# EAGLE board iMX233-OLinuXino-Micro_Rev_A (EAGLE 4.16), part 1 of 2
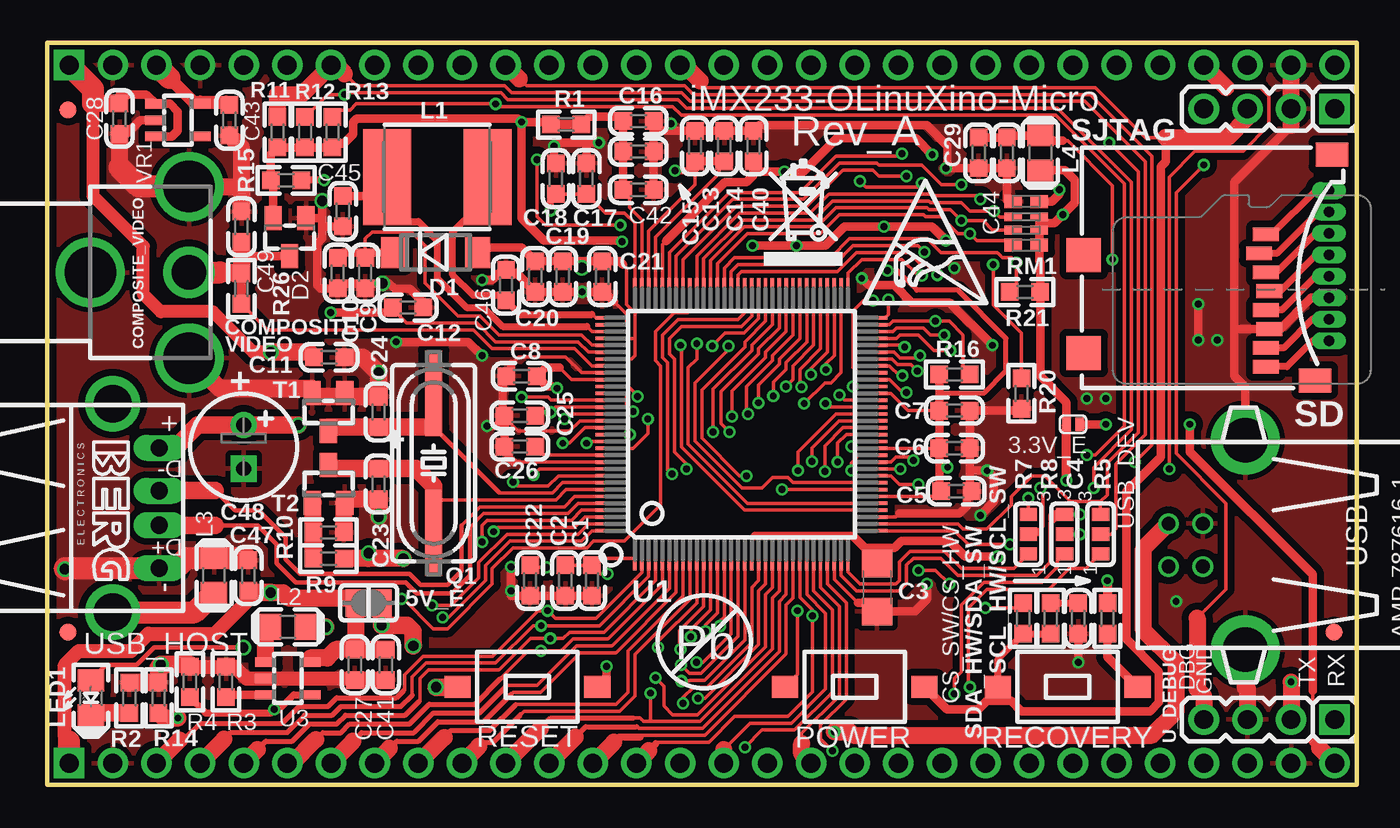
[diagram p1: board, top side]
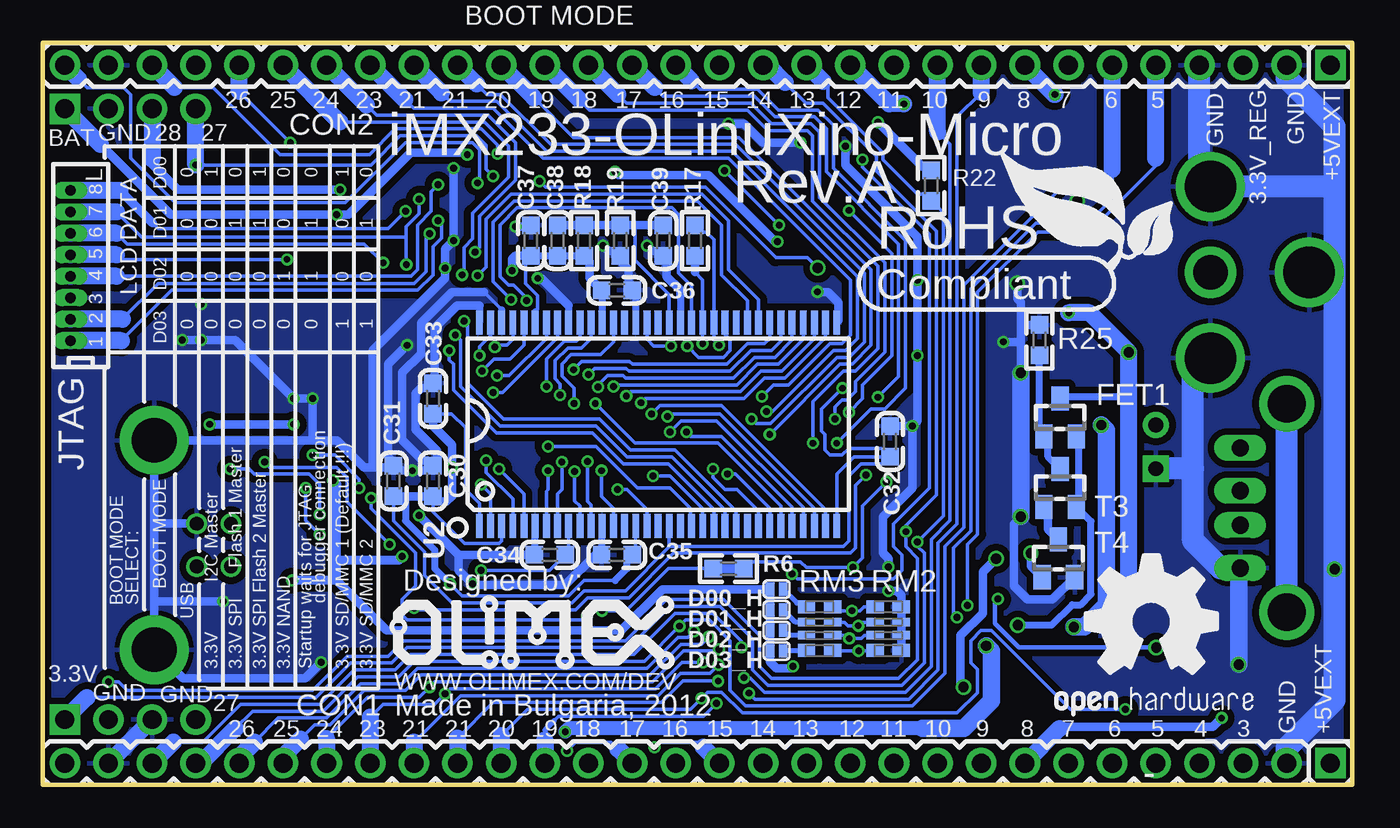
[diagram p2: board, bottom side, seen from below]

Size 76.2 x 43.2 mm. Coordinates in mm from the lower left corner, seen from the top.
Outline: 0,0 76.2,0 76.2,43.2 0,43.2 0,0
Copper layers (1+2*15+16): Top 0.035mm / dielectric 0.5mm / Route2 0.035mm / dielectric 0.5mm / Route15 0.035mm / dielectric 0.5mm / Bottom 0.035mm
Design rules "default": minimum track width 0.0051mm, minimum drill 0.3mm, track to track 0.15mm, track to pad 0.2mm, pad to pad 0.2mm, via to via 0.2mm, smd to smd 1mil, copper to edge 10mil, drill to drill 8mil, minimum pad ring 6mil, minimum via ring 0.15mm, stop-mask expansion 4mil, vias tented up to drill 25mil, thermal gap 12mil
Net classes: 1 pwr: width 0.5 mm, drill 0.2 mm
tRestrict: 1 lines

## Footprints (pad centres in the part's own frame; a part is rotated, then mirrored left to right if it is on the bottom)
SJ_1_SMALLER = smd 0.508 x 0.762: 1 -0.381,0; 2 0.381,0
SJ = smd 1.168 x 1.6: 1 -0.762,0; 2 0.762,0
C0603_DWS = smd 1.016 x 1.016: 1 -0.889,0; 2 0.889,0
C1206 = smd 1.6 x 1.8: 1 -1.4,0; 2 1.4,0
E2,5-6,3 = drill 0.864 pad 1.524 round: + -1.27,0 | drill 0.864 pad 1.524 square: - 1.27,0
VIDEO_CON = drill 3 round: GND1 -5,-5.75; GND2 0,0; GND3 5,-5.75 | drill 2 round: IO 0,-5.75
HN1X30 = drill 1.1 pad 1.778 square: 1 -36.83,0 | drill 1.1 pad 1.778 round: 2 -34.29,0; 3 -31.75,0; 4 -29.21,0; 5 -26.67,0; 6 -24.13,0; 7 -21.59,0; 8 -19.05,0; 9 -16.51,0; 10 -13.97,0; 11 -11.43,0; 12 -8.89,0; 13 -6.35,0; 14 -3.81,0; 15 -1.27,0; 16 1.27,0; 17 3.81,0; 18 6.35,0; 19 8.89,0; 20 11.43,0; 21 13.97,0; 22 16.51,0; 23 19.05,0; 24 21.59,0; 25 24.13,0; 26 26.67,0; 27 29.21,0; 28 31.75,0; 29 34.29,0; 30 36.83,0
SJ_2_SMALL = smd 0.762 x 1.016: 1 -1.143,0; 2 0,0; 3 1.143,0
MLL-41 = smd 1.45 x 1.8: A 2.445,0; K -2.445,0
SOT23C(BAT54S) = smd 1 x 1.4: 1 -0.95,-1.1; 2 0.95,-1.1; 3 0,1.1
SOT23 = smd 1 x 1.4: 1 -0.95,-1.1; 2 0.95,-1.1; 3 0,1.1
WU08S = drill 0.6 pad 0.991 long: 1 -4.375,0; 2 -3.125,0; 3 -1.875,0; 4 -0.625,0; 5 0.625,0; 6 1.875,0; 7 3.125,0; 8 4.375,0
CD53 = smd 2.794 x 5.588: 1 -2.921,0; 2 2.921,0
L0805_5MIL_DWS = smd 1.27 x 1.524: 1 -1.016,0; 2 1.016,0
LED-0805 = smd 1.27 x 1.524: A 1.016,0; C -1.016,0
SW-TAKT_6X3.5_SMD = smd 1.27 x 1.524: P$1 0,4.064; P$2 0,-4.064
HC49/SMD2_THIN = smd 5 x 1: 1 -4.064,0; 2 4.064,0
0603_0R = smd 1.016 x 1.016: 1 -0.889,0; 2 0.889,0
R0603_5MIL_DWS = smd 1.016 x 1.016: 1 -0.889,0; 2 0.889,0
R_MATRIX_4 = smd 1.016 x 0.762: 1.1 -0.762,1.27; 1.2 0.762,1.27; 4.1 -0.762,-1.27; 4.2 0.762,-1.27 | smd 1.016 x 0.508: 2.1 -0.762,0.381; 2.2 0.762,0.381; 3.1 -0.762,-0.381; 3.2 0.762,-0.381
TFR-MEM-CON = smd 0.8 x 1.5: 1 -3.2,10.7; 2 -2.1,10.3; 3 -1,10.7; 4 0.1,10.9; 5 1.2,10.7; 6 2.3,10.9; 7 3.4,10.7; 8 4.5,10.7 | smd 2 x 2: 9 3.7,0.1; 10 -2,0.1 | smd 1.4 x 1.9: 11 5.3,13.55; 12 -7.85,14.55
HN1X4 = drill 1.1 pad 1.778 square: 1 -3.81,0 | drill 1.1 pad 1.778 round: 2 -1.27,0; 3 1.27,0; 4 3.81,0
SOT-23 = smd 1 x 1.4: 1 -0.95,-1.1; 2 0.95,-1.1; 3 0,1.1
TQFP128LD = smd 0.2 x 1.5: 1 -6.2,-7.75; 2 -5.8,-7.75; 3 -5.4,-7.75; 4 -5,-7.75; 5 -4.6,-7.75; 6 -4.2,-7.75; 7 -3.8,-7.75; 8 -3.4,-7.75; 9 -3,-7.75; 10 -2.6,-7.75; 11 -2.2,-7.75; 12 -1.8,-7.75; 13 -1.4,-7.75; 14 -1,-7.75; 15 -0.6,-7.75; 16 -0.2,-7.75; 17 0.2,-7.75; 18 0.6,-7.75; 19 1,-7.75; 20 1.4,-7.75; 21 1.8,-7.75; 22 2.2,-7.75; 23 2.6,-7.75; 24 3,-7.75; 25 3.4,-7.75; 26 3.8,-7.75; 27 4.2,-7.75; 28 4.6,-7.75; 29 5,-7.75; 30 5.4,-7.75; 31 5.8,-7.75; 32 6.2,-7.75; 65 6.2,7.75; 66 5.8,7.75; 67 5.4,7.75; 68 5,7.75; 69 4.6,7.75; 70 4.2,7.75; 71 3.8,7.75; 72 3.4,7.75; 73 3,7.75; 74 2.6,7.75; 75 2.2,7.75; 76 1.8,7.75; 77 1.4,7.75; 78 1,7.75; 79 0.6,7.75; 80 0.2,7.75; 81 -0.2,7.75; 82 -0.6,7.75; 83 -1,7.75; 84 -1.4,7.75; 85 -1.8,7.75; 86 -2.2,7.75; 87 -2.6,7.75; 88 -3,7.75; 89 -3.4,7.75; 90 -3.8,7.75; 91 -4.2,7.75; 92 -4.6,7.75; 93 -5,7.75; 94 -5.4,7.75; 95 -5.8,7.75; 96 -6.2,7.75 | smd 1.5 x 0.2: 33 7.75,-6.2; 34 7.75,-5.8; 35 7.75,-5.4; 36 7.75,-5; 37 7.75,-4.6; 38 7.75,-4.2; 39 7.75,-3.8; 40 7.75,-3.4; 41 7.75,-3; 42 7.75,-2.6; 43 7.75,-2.2; 44 7.75,-1.8; 45 7.75,-1.4; 46 7.75,-1; 47 7.75,-0.6; 48 7.75,-0.2; 49 7.75,0.2; 50 7.75,0.6; 51 7.75,1; 52 7.75,1.4; 53 7.75,1.8; 54 7.75,2.2; 55 7.75,2.6; 56 7.75,3; 57 7.75,3.4; 58 7.75,3.8; 59 7.75,4.2; 60 7.75,4.6; 61 7.75,5; 62 7.75,5.4; 63 7.75,5.8; 64 7.75,6.2; 97 -7.75,6.2; 98 -7.75,5.8; 99 -7.75,5.4; 100 -7.75,5; 101 -7.75,4.6; 102 -7.75,4.2; 103 -7.75,3.8; 104 -7.75,3.4; 105 -7.75,3; 106 -7.75,2.6; 107 -7.75,2.2; 108 -7.75,1.8; 109 -7.75,1.4; 110 -7.75,1; 111 -7.75,0.6; 112 -7.75,0.2; 113 -7.75,-0.2; 114 -7.75,-0.6; 115 -7.75,-1; 116 -7.75,-1.4; 117 -7.75,-1.8; 118 -7.75,-2.2; 119 -7.75,-2.6; 120 -7.75,-3; 121 -7.75,-3.4; 122 -7.75,-3.8; 123 -7.75,-4.2; 124 -7.75,-4.6; 125 -7.75,-5; 126 -7.75,-5.4; 127 -7.75,-5.8; 128 -7.75,-6.2
66TSOP-II = smd 0.4 x 1.4: 1 -10.4,-5.925; 2 -9.75,-5.925; 3 -9.1,-5.925; 4 -8.45,-5.925; 5 -7.8,-5.925; 6 -7.15,-5.925; 7 -6.5,-5.925; 8 -5.85,-5.925; 9 -5.2,-5.925; 10 -4.55,-5.925; 11 -3.9,-5.925; 12 -3.25,-5.925; 13 -2.6,-5.925; 14 -1.95,-5.925; 15 -1.3,-5.925; 16 -0.65,-5.925; 17 0,-5.925; 18 0.65,-5.925; 19 1.3,-5.925; 20 1.95,-5.925; 21 2.6,-5.925; 22 3.25,-5.925; 23 3.9,-5.925; 24 4.55,-5.925; 25 5.2,-5.925; 26 5.85,-5.925; 27 6.5,-5.925; 28 7.15,-5.925; 29 7.8,-5.925; 30 8.45,-5.925; 31 9.1,-5.925; 32 9.75,-5.925; 33 10.4,-5.925; 34 10.4,5.925; 35 9.75,5.925; 36 9.1,5.925; 37 8.45,5.925; 38 7.8,5.925; 39 7.15,5.925; 40 6.5,5.925; 41 5.85,5.925; 42 5.2,5.925; 43 4.55,5.925; 44 3.9,5.925; 45 3.25,5.925; 46 2.6,5.925; 47 1.95,5.925; 48 1.3,5.925; 49 0.65,5.925; 50 0,5.925; 51 -0.65,5.925; 52 -1.3,5.925; 53 -1.95,5.925; 54 -2.6,5.925; 55 -3.25,5.925; 56 -3.9,5.925; 57 -4.55,5.925; 58 -5.2,5.925; 59 -5.85,5.925; 60 -6.5,5.925; 61 -7.15,5.925; 62 -7.8,5.925; 63 -8.45,5.925; 64 -9.1,5.925; 65 -9.75,5.925; 66 -10.4,5.925
SOT23-5 = smd 0.55 x 1.2: 1 -0.95,-1.3; 2 0,-1.3; 3 0.95,-1.3; 4 0.95,1.3; 5 -0.95,1.3
FIDUCIAL-1X2 = smd 1 x 1: 1 0,0
USB_NEAR_BLACK = drill 0.8 round: 1 1.25,6.5; 2 -1.25,6.5; 3 -1.25,4.5; 4 1.25,4.5 | drill 2.6 pad 4 round: P$1 -6.096,2.032; P$2 6.096,2.032
USB_PN87520_HOST_PTH = drill 1 long: 1 -3.5,2.71; 2 -1,2.71; 3 1,2.71; 4 3.5,2.71 | drill 2.2 round: P$1 6.07,0; P$2 -6.07,0
SOT-23-5 = smd 0.55 x 1.2: 1 -0.95,-1.3; 2 0,-1.3; 3 0.95,-1.3; 4 0.95,1.3; 5 -0.95,1.3

## Placement (x,y rotation side)
3.3V_E  Open  [SJ_1_SMALLER]  59.7,21 180 top
5V_E  Open  [SJ]  18.7,10.6 180 top
C1  22uF/6.3V  [C0603_DWS]  31.7,11.9 90 top
C2  22uF/6.3V  [C0603_DWS]  30.15,11.9 90 top
C3  22uF/6.3V  [C1206]  48.3,11.5 90 top
C4  100nF  [C0603_DWS]  60,9.7 270 top
C5  22uF/6.3V  [C0603_DWS]  52.9,17.1 180 top
C6  100nF  [C0603_DWS]  52.8,19.6 180 top
C7  100nF  [C0603_DWS]  52.8,21.8 180 top
C8  22uF/6.3V  [C0603_DWS]  27.6,23.8 0 top
C9  22uF/6.3V  [C0603_DWS]  18.5,29.8 90 top
C10  22uF/6.3V  [C0603_DWS]  16.9,29.8 90 top
C11  22uF/6.3V  [C0603_DWS]  16.4,24.9 180 top
C12  100nF  [C0603_DWS]  21,27.8 180 top
C13  22uF/6.3V  [C0603_DWS]  37.7,37.2 270 top
C14  100nF  [C0603_DWS]  39.4,37.2 270 top
C15  22uF/6.3V  [C0603_DWS]  34.4,36.88 180 top
C16  100nF  [C0603_DWS]  34.4,38.65 180 top
C17  22uF/6.3V  [C0603_DWS]  31.38,35.3 270 top
C18  100nF  [C0603_DWS]  29.6,35.3 270 top
C19  22uF/6.3V  [C0603_DWS]  30,29.6 90 top
C20  22uF/6.3V  [C0603_DWS]  28.4,29.6 90 top
C21  22uF/6.3V  [C0603_DWS]  32.3,29.6 90 top
C22  100nF  [C0603_DWS]  28.1,11.9 90 top
C23  33pF  [C0603_DWS]  19.29,17.53 90 top
C24  33pF  [C0603_DWS]  19.29,21.72 270 top
C25  100nF  [C0603_DWS]  27.5,21.5 0 top
C26  1uF  [C0603_DWS]  27.5,19.7 0 top
C27  22uF/6.3V  [C0603_DWS]  17.9,7 270 top
C28  22uF/6.3V  [C0603_DWS]  4.2,38.8 270 top
C29  22uF/6.3V  [C0603_DWS]  54.2,36.8 90 top
C30  100nF  [C0603_DWS]  53.5,17.7 270 bottom
C31  100nF  [C0603_DWS]  55.8,17.7 270 bottom
C32  100nF  [C0603_DWS]  26.9,20 270 bottom
C33  100nF  [C0603_DWS]  53.5,22.5 270 bottom
C34  100nF  [C0603_DWS]  46.7,13.4 0 bottom
C35  100nF  [C0603_DWS]  42.8,13.4 0 bottom
C36  100nF  [C0603_DWS]  42.8,28.8 180 bottom
C37  100nF  [C0603_DWS]  47.8,31.7 270 bottom
C38  100nF  [C0603_DWS]  46.25,31.7 90 bottom
C39  100nF  [C0603_DWS]  40.1,31.7 90 bottom
C40  22uF/6.3V  [C0603_DWS]  41.1,37.2 270 top
C41  100nF  [C0603_DWS]  19.7,7 270 top
C42  22uF/6.3V  [C0603_DWS]  34.4,34.65 180 top
C43  22uF/6.3V  [C0603_DWS]  10.6,38.7 270 top
C44  22uF/6.3V  [C0603_DWS]  55.85,36.8 90 top
C45  NA(10pF)  [C0603_DWS]  17.2,33.4 90 top
C46  NA(10pF)  [C0603_DWS]  26.7,29.1 270 top
C47  22uF/6.3V  [C0603_DWS]  11.7,12.2 90 top
C48  100uF/35V/LOWESR/105C/6.3x11mm_RM2.5  [E2,5-6,3]  11.43,19.68 270 top
C49  51pF  [C0603_DWS]  11.3,32.5 90 top
COMPOSITE_VIDEO  VIDEO_CON  [VIDEO_CON]  2.5,29.84 90 top
CON1  HN1X30  [HN1X30]  38.1,1.27 180 bottom
CON2  HN1X30  [HN1X30]  38.1,41.91 180 bottom
CS_SW/CS_HW  SDA_HW:Open/SDA_SW:Close  [SJ_2_SMALL]  57.1,14.6 90 top
D00_H  Close  [SJ_1_SMALLER]  33.5,11.4 180 bottom
D1  SCHOTKKY7.62SS2  [MLL-41]  22.6,31 0 top
D01_H  Open  [SJ_1_SMALLER]  33.5,10.2 180 bottom
D2  BAT54S  [SOT23C(BAT54S)]  14.1,31.9 180 top
D02_H  Open  [SJ_1_SMALLER]  33.5,9 180 bottom
D03_H  Close  [SJ_1_SMALLER]  33.5,7.8 180 bottom
FET1  NA(IRLML6402)  [SOT23]  17,21.4 0 bottom
JTAG  NA(WU08S)  [WU08S]  74.6,30.24 90 bottom
L1  22uH/1.5A/CD53  [CD53]  22.7,35.4 0 top
L2  FB0805/600R/2A  [L0805_5MIL_DWS]  14,9.2 180 top
L3  FB0805/600R/200mA(201209-601)  [L0805_5MIL_DWS]  9.7,12.2 270 top
L4  CL470nH/0805/1.76R/250mA  [L0805_5MIL_DWS]  57.8,36.8 90 top
LED1  LED/GREEN/3MM  [LED-0805]  2.54,5.08 90 top
POWER  T1107A(6x3,8x2,5mm)  [SW-TAKT_6X3.5_SMD]  46.99,5.71 90 top
Q1  Q24.000MHz/HC-49SM/SMD/20ppm/20pF  [HC49/SMD2_THIN]  22.48,18.74 270 top
R1  0R(Board_Mounted)  [0603_0R]  30.2,38.45 0 top
R2  560R  [R0603_5MIL_DWS]  4.78,5.08 270 top
R3  10k  [R0603_5MIL_DWS]  10.4,6 270 top
R4  10k  [R0603_5MIL_DWS]  8.3,6 270 top
R5  10k  [R0603_5MIL_DWS]  61.7,9.7 90 top
R6  0R(Board_Mounted)  [0603_0R]  36.3,12.6 0 bottom
R7  1k/1%  [R0603_5MIL_DWS]  56.8,9.7 270 top
R8  1k/1%  [R0603_5MIL_DWS]  58.4,9.7 270 top
R9  2.2k  [R0603_5MIL_DWS]  16.36,13.18 0 top
R10  2.2k  [R0603_5MIL_DWS]  16.36,14.71 0 top
R11  2.2k  [R0603_5MIL_DWS]  13.4,38 270 top
R12  2.2k  [R0603_5MIL_DWS]  15,38 270 top
R13  47k  [R0603_5MIL_DWS]  16.6,38 270 top
R14  47k  [R0603_5MIL_DWS]  6.48,5.08 270 top
R15  47k  [R0603_5MIL_DWS]  13.9,35.2 0 top
R16  10k  [R0603_5MIL_DWS]  52.8,23.9 180 top
R17  110R  [R0603_5MIL_DWS]  38.25,31.7 90 bottom
R18  1k/1%  [R0603_5MIL_DWS]  44.7,31.7 270 bottom
R19  1k/1%  [R0603_5MIL_DWS]  42.6,31.7 90 bottom
R20  1M  [R0603_5MIL_DWS]  56.7,22.8 270 top
R21  10k  [R0603_5MIL_DWS]  56.9,28.7 0 top
R22  100k  [R0603_5MIL_DWS]  24.5,34.9 270 bottom
R25  NA(47k)  [R0603_5MIL_DWS]  18.2,25.9 270 bottom
R26  0R(Board_Mounted)  [0603_0R]  11.3,28.9 90 top
RECOVERY  T1107A(6x3,8x2,5mm)  [SW-TAKT_6X3.5_SMD]  59.39,5.71 270 top
RESET  T1107A(6x3,8x2,5mm)  [SW-TAKT_6X3.5_SMD]  27.94,5.71 90 top
RM1  RA1206_(4X0603)_4B8_100K  [R_MATRIX_4]  56.97,32.69 0 top
RM2  RA1206_(4X0603)_4B8_47K  [R_MATRIX_4]  27,9.1 0 bottom
RM3  RA1206_(4X0603)_4B8_4.7K  [R_MATRIX_4]  31,9.1 0 bottom
SCL_HW/SCL_SW  SCL_HW:Open/SCL_SW:Close  [SJ_2_SMALL]  61.3,14.6 90 top
SD  MICRO  [TFR-MEM-CON]  60.23,28.85 270 top
SDA_HW/SDA_SW  SDA_HW:Open/SDA_SW:Close  [SJ_2_SMALL]  59.2,14.6 90 top
SJTAG  (NA)HN1X4  [HN1X4]  71.12,39.37 180 top
T1  BC846B  [SOT23]  16.36,21.72 180 top
T2  BC846B  [SOT23]  16.36,17.53 0 top
T3  NA(DTA114YKA)  [SOT-23]  17,17.3 0 bottom
T4  NA(DTC114YKA)  [SOT-23]  17.1,13.2 0 bottom
U1  MCIMX233CAG4C  [TQFP128LD]  40.4,21 0 top
U2  HY5DU121622D(L)T(P)-J  [66TSOP-II]  40.4,21 0 bottom
U3  SY6280  [SOT23-5]  14,6.2 270 top
U$1  FIDUCIAL1X2  [FIDUCIAL-1X2]  1.2,39.3 180 top
U$2  FIDUCIAL1X2  [FIDUCIAL-1X2]  1.2,8.9 180 top
U$3  FIDUCIAL1X2  [FIDUCIAL-1X2]  74.9,8.9 180 top
U$5  [LOGO-OPENHARDWARE_8X8]  11.7,9.44 0 bottom
U$8  [OLIMEX1_V]  38.3,6.62 0 bottom
U$9  [PB]  38.24,8.34 0 top
U$10  [ESD_SYMBOL]  47.55,28.06 0 top
U$11  [RECYCLE_BIN1/8]  41.71,30.25 0 top
U$12  [ROHS]  27.7,28.3 0 bottom
U_DEBUG  NA(HN1X4)  [HN1X4]  71.12,3.81 180 top
USB_DEV  USB-B  [USB_NEAR_BLACK]  71.75,13.97 90 top
USB_HOST  USB_A  [USB_PN87520_HOST_PTH]  3.81,16.13 270 top
VR1  AP1231-33  [SOT-23-5]  7.6,38.7 270 top

## Tracks (layer width: path | path; a pad name or v marks a point on that pad's centre or on a via)
+5V  (via drill 0.4, 0.6)
  Top 0.2: U1.102 31.5,25.2 30.9,25.8 26.1,25.8 25,26.9 20.9,26.9 20.3,27.5
  Top 0.254: 15.3,7.4 U3.5
  Top 0.5: 20.11,27.5 20.3,27.5 | v16.5,27.5 20.11,27.5 | 20.11,27.5 C12.2
  Top 0.508: VR1.3 7.25,37.75 7.6,38.1 7.6,39.2 7.15,39.65 VR1.1 5.75,40.2 4.2,40.2 C28.1
  Top 0.762: 1.27,2.54 1.02,2.79 | v13,25.2 11.98,25.2 9.62,27.56 6.6,27.56 5.59,28.57 5.59,31.37 2.67,34.29 2.67,39.69
  Top 0.8: 1.02,2.79 1.02,6.99 1.83,7.8 4.88,7.8 5.88,8.8 9.75,8.8 11.7,10.75 11.7,11.2
  Top 1: C41.1 17.94,7.89 5V_E.2 17.64,10.9 14,10.9 13.7,11.2 v13,11.2 | C27.1 16.79,7.89 16.3,7.4 15.3,7.4 | 2.67,39.69 C28.1
  Top 1.016: 17.94,7.89 C27.1 | C47.1 11.7,11.2 v13,11.2 | v13,25.2 15.21,25.2 C11.2
  Top 1.27: CON1.1 1.27,2.54 | CON2.1 2.67,40.51 2.67,39.69
  Bottom 0.4: FET1.3 16.9,22.6 13,22.6
  Bottom 1: v16.5,27.5 15.3,27.5 v13,25.2 13,22.6 v13,11.2
+5V_HOST_PWR  (via drill 0.6)
  Top 1.016: L2.1 v16.2,9.2 | v14.6,20.95 C48.+ 8.76,20.95 7.43,19.63 USB_HOST.1
  Bottom 1.016: v16.2,9.2 15.6,9.2 14.3,10.5 14.3,20.66 v14.6,20.95
+24V  (via drill 0.4, 0.6)
  Top 0.2: 34.2,26 U1.100 | 33.51,30.29 33.7,30.1 33.7,27.98 34.2,27.48 34.2,26 | v47.3,35.15 47.65,34.8 50.65,34.8 v50.9,35.05 | U1.103 34,24.8 34.2,25 34.2,26
  Top 0.203: C19.2
  Top 0.5: 33.51,30.29 33.31,30.49 C21.2 31.1,30.49 | 31.1,30.49 C19.2 C20.2 27.59,31.3 25.34,31.3 D1.A | 31.1,30.49 v31.1,30.1
  Bottom 0.2: v31.1,30.1 31.7,30.7 33.55,30.7 37.65,34.8 46.95,34.8 v47.3,35.15 | v50.9,35.05 50.8,35.15 50.8,37 51.2,37.4 55.1,37.4 58.6,33.9 68.5,33.9 71.1,36.5 71.1,40.2 71.5,40.6 73.62,40.6 74.12,41.1
  Bottom 1: 74.12,41.1 CON2.30
A0  (via drill 0.4)
  Top 0.2: U1.76 42.2,26.8 41,25.6 41,25.3 38.75,23.05 v38.75,20.55
  Bottom 0.2: U2.29 32.6,16.2 36.7,20.3 38.5,20.3 v38.75,20.55
A1  (via drill 0.4)
  Top 0.2: U1.75 42.6,26.6 41.4,25.4 41.4,25.1 39.2,22.9 39.2,21.05 v39.7,20.55
  Bottom 0.2: U2.30 31.95,16.15 37,21.2 39.05,21.2 v39.7,20.55
A2  (via drill 0.4)
  Top 0.2: U1.74 43,26.4 41.8,25.2 41.8,24.9 39.85,22.95 v39.85,21.45
  Bottom 0.2: U2.31 31.3,16.1 36.8,21.6 39.7,21.6 v39.85,21.45
A3  (via drill 0.4)
  Top 0.2: U1.73 43.4,26.2 42.2,25 42.2,24.7 40.7,23.2 40.7,21.68 v40.77,21.6
  Bottom 0.2: U2.32 30.65,16.05 36.7,22.1 40.27,22.1 v40.77,21.6
A4  (via drill 0.4)
  Top 0.2: v41.4,22.25 41.4,23.3 42.6,24.5 42.6,24.8 43.8,26 U1.72
  Bottom 0.2: v41.4,22.25 41.15,22.5 35.4,22.5 34.2,23.7 33,23.7 30.65,26.05 U2.35
A5  (via drill 0.4)
  Top 0.2: v42.25,22.65 42.25,23.45 43,24.2 43,24.6 44.2,25.8 U1.71
  Bottom 0.2: v42.25,22.65 42,22.9 35.6,22.9 34.4,24.1 33.2,24.1 31.3,26 U2.36
A6  (via drill 0.4)
  Top 0.2: v43,23.2 43.4,23.6 43.4,24.4 44.6,25.6 U1.70
  Bottom 0.2: v43,23.2 42.9,23.3 35.8,23.3 34.6,24.5 33.4,24.5 31.95,25.95 U2.37
A7  (via drill 0.4)
  Top 0.2: v43.9,23.18 43.9,23.3 43.8,23.4 43.8,24.2 45,25.4 U1.69
  Bottom 0.2: v43.9,23.18 43.9,23.3 43.35,23.85 42.45,23.85 42.3,23.7 36,23.7 34.8,24.9 33.6,24.9 32.6,25.9 U2.38
A8  (via drill 0.4)
  Top 0.2: v44.45,23.9 44.45,24.25 45.4,25.2 U1.68
  Bottom 0.2: v44.45,23.9 44.1,24.25 42.25,24.25 42.1,24.1 36.2,24.1 35,25.3 33.8,25.3 33.25,25.85 U2.39
A9  (via drill 0.4)
  Top 0.2: v45.33,24.18 45.33,24.52 45.8,25 U1.67
  Bottom 0.2: v45.33,24.18 44.85,24.65 42.05,24.65 41.9,24.5 36.4,24.5 35.2,25.7 34.2,25.7 33.9,26 U2.40
A10  (via drill 0.4)
  Top 0.2: U1.66 46.2,24 45.6,23.4 45.25,23.4 v44.05,22.2
  Bottom 0.2: U2.28 33.25,16.25 36.9,19.9 41.75,19.9 v44.05,22.2
A11  (via drill 0.4)
  Top 0.2: v50.9,29.65 50.7,29.65 49.75,30.6 47.4,30.6 46.6,29.8 U1.65
  Bottom 0.2: U2.41 34.55,28.25 36.3,30 36.3,32.85 37.85,34.4 48.95,34.4 50.4,32.95 50.4,30.15 v50.9,29.65
A12  (via drill 0.4)
  Top 0.2: U1.64 48.75,27.2 48.95,27.4 v48.95,28.25
  Bottom 0.2: U2.42 35.2,28.2 36.7,29.7 36.7,32.6 38.1,34 48.77,34 50,32.77 50,29.3 v48.95,28.25
AUART1_RXD  (via drill 0.4)
  Top 0.2: U1.128 31.7,14.8 31.1,14.2 26.93,14.2 25.5,12.78 25.5,11.9 23.35,9.75 v23,9.75
  Bottom 0.2: v23,9.75 23.2,9.95 23.2,13.8 22.2,14.8 22.2,28.9 18.4,32.7 15.4,32.7 13.97,34.13 13.97,35.83
  Bottom 1: 13.97,35.83 CON2.6
AUART1_TXD  (via drill 0.4)
  Top 0.2: U1.127 31.5,15.2 30.9,14.6 26.75,14.6 25.1,12.95 25.1,12.05 23.5,10.45 v22.4,10.45
  Bottom 0.2: v22.4,10.45 22.4,14 21.8,14.6 21.8,28.7 18.3,32.2 15.3,32.2 11.43,36.07 11.43,36.47
  Bottom 1: 11.43,36.47 CON2.5
BA0  (via drill 0.4)
  Top 0.2: U1.79 41,27.3 40.4,26.7 36.9,26.7 36.2,26 36.2,25.1 36.5,24.8 36.5,19.4 37.2,18.7 v37.2,18.4
  Bottom 0.2: U2.26 34.55,15.95 35.8,17.2 36.5,17.2 37.2,17.9 v37.2,18.4
BA1  (via drill 0.4)
  Top 0.2: U1.80 40.6,27.5 40.2,27.1 36.7,27.1 35.8,26.2 35.8,24.9 36.1,24.6 36.1,18.35 v36.35,18.1
  Bottom 0.2: U2.27 33.9,16.1 35.9,18.1 v36.35,18.1
CASN  (via drill 0.4)
  Top 0.2: U1.61 49.42,26 49.62,26.2 50.7,26.2 51.6,25.3 v52.55,25.3
  Bottom 0.2: U2.22 37.15,16.05 39.8,18.7 42.4,18.7 44.2,20.5 49.8,20.5 52.3,23 52.3,24.5 52.55,24.75 v52.55,25.3
CKE  (via drill 0.4)
  Top 0.2: v38.7,25.55 39.45,26.3 40.55,26.3 41.4,27.15 U1.78
  Bottom 0.2: v38.7,25.55 38.05,24.9 36.6,24.9 36.2,25.3 36.2,25.93 36.5,26.23 U2.44
CLK  (via drill 0.4)
  Top 0.2: 48.2,16 U1.36 40.58,16 36.9,19.68 36.9,25.55 v36.85,25.6
  Bottom 0.2: v36.85,25.6 37.15,25.9 U2.45 37.15,31.75 37.6,32.2 37.86,32.2 R17.2
CLKN  (via drill 0.4)
  Top 0.2: v37.8,25.7 37.8,24.8 37.3,24.3 37.3,19.85 40.75,16.4 U1.37
  Bottom 0.2: v37.8,25.7 U2.46 37.8,29.4 38.25,29.85
  Bottom 0.5: 38.25,29.85 R17.1
CS  (via drill 0.4)
  Top 0.2: R16.1 53.3,24.29 53.3,26.2 52.5,27 v51.7,27 49.23,27 49.02,26.8 U1.63
  Bottom 0.2: U2.24 35.85,15.95 39.4,19.5 42,19.5 43.8,21.3 49.4,21.3 51.5,23.4 51.5,26.8 v51.7,27
CS_UEXT
  Top 0.2: U1.32 46.6,12.4 47.3,11.7 49.4,11.7 49.6,11.9 49.6,13 50.2,13.6 52.2,13.6 53.2,12.6 56.24,12.6 CS_SW/CS_HW.1
CS_UEXT_GPIO  (via drill 0.4)
  Top 0.2: v57.8,17.3 57.95,17.15 57.95,15.05 57.62,14.72 | v60.5,19.2 61,19.2 62.7,20.9 62.7,35 58.7,39 36.9,39 36.4,39.5 26.25,39.5 v26.1,39.65 17.96,39.65 17.61,39.3 17.01,39.3 R13.1
  Top 0.5: 57.62,14.72 57.23,14.72 CS_SW/CS_HW.2
  Bottom 0.2: v57.8,17.3 57.8,17.8 59.2,19.2 v60.5,19.2
  Bottom 1: CON2.12 26.95,39.65 v26.1,39.65
D0  (via drill 0.4)
  Top 0.2: U1.41 49.1,18 49.6,17.5 v50.7,17.5
  Bottom 0.2: v50.7,17.5 50.15,16.95 U2.2
D1  (via drill 0.4)
  Top 0.2: U1.43 49.1,18.8 49.4,19.1 50.2,19.1 v50.4,18.9
  Bottom 0.2: v50.4,18.9 50.4,18.2 48.85,16.65 U2.4
D2  (via drill 0.4)
  Top 0.2: v49.65,18.4 U1.42
  Bottom 0.2: v49.65,18.4 48.2,16.95 U2.5
D3  (via drill 0.4)
  Top 0.2: v46.8,18.3 46.8,18.75 47.25,19.2 U1.44
  Bottom 0.2: v46.8,18.3 46.8,17.2 46.9,17.1 U2.7
D4  (via drill 0.4)
  Top 0.2: U1.47 46.5,20.4 46,19.9 v46,18.8
  Bottom 0.2: v46,18.8 46,17.2 46.25,16.95 U2.8
D5  (via drill 0.4)
  Top 0.2: v45.25,18.25 45.25,19.75 46.3,20.8 U1.48
  Bottom 0.2: U2.10 44.95,16.25 45.25,16.55 v45.25,18.25
D6  (via drill 0.4)
  Top 0.2: U1.49 46.08,21.2 44.5,19.62 v44.5,18.82
  Bottom 0.2: U2.11 44.3,16.3 44.5,16.5 v44.5,18.82
D7  (via drill 0.4)
  Top 0.2: U1.50 45.9,21.6 43.7,19.4 v43.7,18.3
  Bottom 0.2: U2.13 43,16.1 43.7,16.8 v43.7,18.3
D8  (via drill 0.4)
  Top 0.2: U1.51 45.5,22 v45.3,22.2
  Bottom 0.2: U2.54 43,25.8 43.75,25.05 45.45,25.05 46,24.5 46,23.8 45.3,23.1 v45.3,22.2
D9  (via drill 0.4)
  Top 0.2: U1.52 46.4,22.4 v46.1,22.7
  Bottom 0.2: v46.1,22.7 46.1,23.35 46.4,23.65 46.4,24.7 45.65,25.45 44.85,25.45 44.3,26 U2.56
D10  (via drill 0.4)
  Top 0.2: v46.9,23.2 U1.54
  Bottom 0.2: U2.57 44.95,26.05 45.15,25.85 45.85,25.85 46.9,24.8 v46.9,23.2
D11  (via drill 0.4)
  Top 0.2: v50,22.85 49.77,22.85 49.02,23.6 U1.55
  Bottom 0.2: U2.59 46.25,26.05 49.45,22.85 v50,22.85
D12  (via drill 0.4)
  Top 0.2: U1.57 49.02,24.4 49.6,23.82 v49.77,23.82
  Bottom 0.2: U2.60 46.9,26 49.08,23.82 v49.77,23.82
D13  (via drill 0.4)
  Top 0.2: U1.58 49.15,24.8 49.48,24.48 50.27,24.48 v50.65,24.1
  Bottom 0.2: v50.65,24.1 49.95,24.8 49,24.8 48.2,25.6 U2.62
D14  (via drill 0.4)
  Top 0.2: U1.60 49.8,25.6 v49.9,25.5
  Bottom 0.2: v49.9,25.5 49.8,25.6 49.2,25.6 48.85,25.95 U2.63
D15  (via drill 0.4)
  Top 0.2: U1.59 49.27,25.2 49.62,24.85 50.65,24.85 v50.8,25
  Bottom 0.2: v50.8,25 50.8,25.52 50.15,26.18 U2.65
DCDC_VDDA  (via drill 0.4)
  Top 0.2: U1.110 29.59,22 v29.29,21.7 28.59,21.7 C25.2 | U1.96 34.2,32.7 33.6,33.3 32.49,33.3 C17.2 C18.2
  Top 0.4: C18.2 29.5,34.41 29.3,34.21 v29.3,33.45
  Bottom 0.2: v29.29,21.7 28.5,22.49 28.5,23.3 26.8,25 26.8,30.95 v29.3,33.45
DCDC_VDDD  (via drill 0.4)
  Top 0.2: U1.1 34.15,13.2 32.11,13.2 C1.2 | U1.94 35,32.25 37.7,34.95 37.7,35.77 | U1.93 35.4,31.9 39.1,35.6 39.1,36.01 C14.2 | C1.2 C2.2 | v32.6,12.3 32.19,12.3 C1.2 | v28.5,36.4 28.5,33.1 29,32.6 v33.35,32.6
  Top 0.4: C13.2 37.7,35.77 v36.52,35.77
  Top 0.5: C13.2 C14.2
  Bottom 0.2: v32.6,12.3 32.3,12 26.7,12 26.2,12.5 26.2,13.4 26.7,13.9 26.7,15.2 24.6,17.3 24.6,32.08 28.5,35.98 v28.5,36.4 | v33.35,32.6 v36.52,35.77
DCDC_VDDIO
  Top 0.2: U1.95 34.6,32.9 33.9,33.6 33.9,34.26 C42.2
  Top 0.5: C42.2 C15.2 C16.2 33.26,38.9 31.54,38.9 R1.2
DEBUG  (via drill 0.4)
  Top 0.2: U1.89 37,30.6 40.1,33.7 44.2,33.7 46.3,35.8 48.05,35.8 48.4,35.45 v50,35.45 | 66.92,9.72 68.6,11.4 68.6,16.4 65.7,19.3 65.7,34.49 v67.31,36.1
  Top 1: 66.92,9.72 66.92,5.58 67.31,5.19 U_DEBUG.4
  Bottom 0.2: v50,35.45 50.4,35.85 50.4,37.25 50.95,37.8 55.4,37.8 57.1,36.1 v67.31,36.1
  Bottom 1: v67.31,36.1 SJTAG.4
DQM0  (via drill 0.4)
  Top 0.2: U1.46 47.1,20 v46.8,19.7
  Bottom 0.2: U2.20 38.5,15.12 38.5,16.1 39.7,17.3 41.6,17.3 44,19.7 v46.8,19.7
DQM1  (via drill 0.4)
  Top 0.2: U1.56 47.2,24 46.9,24.3 46.9,27.6 47.5,28.2 v48.05,28.2
  Bottom 0.2: U2.47 38.45,29.05 39.2,29.8 39.2,33.2 39.6,33.6 48.6,33.6 49.6,32.6 49.6,29.6 49.1,29.1 48.8,29.1 48.05,28.35 v48.05,28.2
DQS0  (via drill 0.4)
  Top 0.2: v42.75,17.2 U1.39
  Bottom 0.2: U2.16 41.05,16.05 42.2,17.2 v42.75,17.2
DQS1  (via drill 0.4)
  Top 0.2: U1.40 43.4,17.6 43.1,17.9 42.2,17.9 41.6,17.3 40.42,17.3 37.7,20.02 37.7,23.4 39.65,25.35 v39.65,25.55
  Bottom 0.2: v39.65,25.55 40.65,25.55 41.05,25.95 U2.51
GND  (via drill 0.4, 0.6)
  Top 0.2: 27.12,18.8 U1.118 | 26.85,21.15 27.4,20.6 30.4,20.6 31,21.2 U1.112 | 27,24.5 27.43,24.93 30.18,24.93 31.1,24 U1.105 | U1.98 33.6,26.8 33.7,26.9 33.7,27.43 32.98,28.15 | 49.6,15.8 49.4,15.6 U1.35 | U1.30 45.8,11.97 47.17,10.6
  Top 0.5: 11.57,13.22 C47.2 | 27.12,18.8 26.85,19.07 26.85,19.46 C26.1 26.61,20.9 | C25.1 26.85,21.26 26.85,21.15 | 27,24.5 27,24.09 C8.1 26.5,23.59 26.5,21.61 C25.1 | 32.98,28.15 32.41,28.71 C21.1 v31.11,28.71 C19.1 C20.1 27.31,29.8 26.7,29.8 | C42.1 C15.1 35.29,38.1 | 35.29,38.1 C16.1 | 49.6,15.8 53.1,15.8 53.52,16.23 53.52,16.84 C5.1 53.69,17.2 53.69,18.3 | C1.1 C2.1 C22.1 27,11.01 | v41.05,31.4 v43.6,31.4 45.3,31.4 46.4,32.5 v48.7,32.5 51.5,32.5 v52.3,31.7 | RM1.1.1 55.94,33.96 55.85,34.05 C44.1 C29.1 52.4,35.91 | v47.4,29.5 47.8,29.1 49.3,29.1 50.3,28.1 52.5,28.1 v55,25.6 | v27,12.7 27,11.01 | 26.61,20.9 C25.1 | 53.69,18.3 C6.1 C7.1 56.59,21.8 R20.2 | 53.69,18.3 v54.7,18.3 55.1,17.9 55.1,16.5 v54.3,15.7 | JTAG.3 73.56,28.36 71.75,26.55 SD.6 69.1,26.55 | 69.1,26.55 69.1,35.1 72.39,38.39 | USB_DEV.P$2 69.72,23.18 69.1,23.8 69.1,26.55 | v25.6,20.9 26.61,20.9 | 27,11.01 v27,11.3 | v25.3,29.4 25.9,29.4 26.3,29.8 26.7,29.8 | 18.5,29.2 v19.5,29.2 19.9,29.2 20.2,28.9 21.1,28.9 21.7,28.3 21.7,27.99 C12.1 | 18.5,29.2 17.19,29.2 C10.1 15.89,28.91 15.7,29.1 15.7,31.5 16,31.8 16,32.51 | 52.4,35.91 52.4,37.2 51.2,38.4 41.41,38.4 C40.1 C14.1 C13.1 | v20.3,25.8 24.5,25.8 v25.3,25 | 52.4,35.91 v52.3,35.91 | v60,7.15 C4.2 | v51.2,11.7 51.2,10.8 50.5,10.1 C3.1 47.8,10.6 47.17,10.6 | 36.3,38.1 C13.1 | 36.3,38.1 35.29,38.1 | C13.1 | 31.38,37.4 C17.1 | v36.3,38.5 36.3,38.1 | C18.1 29.5,36.29 v29.5,37.2 29.7,37.4 31.38,37.4 | 31.38,37.4 v32.1,37.4 | v67,25.9 v67,28 | 16,32.51 16,33 | 16,33 v16,34 | 16,32.51 C45.1 | C9.1 18.5,29.2 | 26.7,29.8 C46.1 | 16,33 D2.1
  Top 0.508: C28.2 4.61,37.91 5.4,38.7 VR1.2
  Top 0.762: 11.58,6.22 11.58,6.2
  Top 0.8: R4.1 R3.1 10.92,6.89 11.58,6.22 | 11.58,6.2 U3.2 17.9,6.2 C27.2
  Top 1: 17.25,16.43 R10.2 | T2.2 17.31,16.64 C23.1 v19.29,15.62 | 4.2,35.95 C28.2 | COMPOSITE_VIDEO.GND3 11.3,34.84 | 11.3,34.84 C49.2 | 11.3,34.84 11.3,37.11 C43.2 | U_DEBUG.3 69.85,5.57 69.72,5.7 USB_DEV.P$1 | CON2.29 SJTAG.2 72.39,38.39 | C27.2 C41.2
  Top 1.016: R2.1 R14.1 6.48,6.88 v6.6,7.01 8.3,7.01 R4.1 | T2.2 17.25,16.43 | 17.31,22.61 T1.1 | 15.41,22.61 T1.2 | 15.41,22.61 17.31,22.61 | 17.31,22.61 C24.1 v19.29,24 18.38,24.9 C11.1 | 15.41,22.61 15.41,23.07 10.03,23.07 COMPOSITE_VIDEO.GND1
  Top 1.27: 11.57,13.22 L3.1 8.12,13.22 7.53,12.63 USB_HOST.4 1.02,12.63 v1.02,12.57 | COMPOSITE_VIDEO.GND3 5.31,34.84 4.2,35.95
  Bottom 0.2: 50.52,28.7 49.5,27.68
  Bottom 0.4: 39.1,28.5 U2.48 | 41.7,28.8 U2.52 | 47.55,13.4 U2.6 | 49.5,27.68 U2.64 | 50.8,27.9 U2.66 | 45.6,27.9 U2.58 | 29.9,27.02 U2.34
  Bottom 0.406: 43.65,13.4 U2.12
  Bottom 0.5: v19.29,24 19.29,25.8 | 19.29,25.8 19.29,26.79 | 19.29,26.79 19.29,28.11 19.5,28.33 v19.5,29.2 | v43.6,31.4 43.27,31.07 42.86,31.07 R19.1 42.6,30.5 42.12,30.02 42.12,29.01 C36.1 41.7,28.8 | v41.05,31.4 40.73,31.07 40.36,31.07 C39.1 39.9,30.61 39.9,29.61 39.1,28.81 39.1,28.5 | C37.1 47.89,32.5 v48.7,32.5 | 47.55,13.4 C34.1 52,13.4 | 43.65,13.4 C35.1 44.05,13.4 45.8,11.65 51.15,11.65 v51.2,11.7 52,12.5 52,13.4 | 50.52,28.7 52.4,28.7 54.2,26.9 54.2,25.1 55.3,24 55.3,20.1 54.1,18.9 53.81,18.9 C30.1 | 50.8,27.9 52.1,27.9 53.4,26.6 53.4,23.49 C33.1 53.5,23.3 53.7,23.1 54.2,23.1 54.5,22.8 54.5,20.7 53.25,19.45 53.25,18.84 C30.1 | v47.4,29.5 47.2,29.5 45.6,27.9 | v55,25.6 56.1,24.5 56.1,19.09 55.8,18.79 C31.1 | v25.6,20.9 26.89,20.9 C32.1 | v25.6,20.9 25.6,17.3 27.3,15.6 27.3,13.5 27,13.2 v27,12.7 | C30.1 53.79,18.3 v54.7,18.3 55.51,18.3 C31.1 | C31.1 55.89,18.5 57,18.5 | 57,18.5 57,25.3 52.8,29.5 v52.8,30.1 52.8,31.2 v52.3,31.7 v52.3,35.91 | 69.72,10.7 USB_DEV.P$1 68.05,6.2 60.95,6.2 v60,7.15 | 57,18.5 57.5,18.5 59.07,20.07 60.5,20.07 | 60.5,20.07 USB_DEV.P$2 69.72,15.22 | RM2.4.2 RM2.3.2 RM2.2.2 RM2.1.2 26.24,11.05 26.49,11.3 v27,11.3 | v25.6,20.9 25.3,21.2 v25.3,25 v25.3,29.4 25.3,31.9 29.5,36.1 v29.5,37.2 | v31.11,28.71 30.51,28.71 29.9,28.1 29.9,27.02 | 69.72,15.22 USB_DEV.4 | 19.29,25.8 v20.3,25.8 | v54.3,15.7 52,13.4 | v36.3,38.5 35.4,38.5 34.3,37.4 v32.1,37.4 | 69.72,10.7 v65.7,10.7 | 69.72,15.22 69.72,10.7 | 60.5,20.07 v60.5,22.5 v61.6,22.5 65,25.9 v67,25.9 v68.1,25.9 | 19.29,26.79 R25.1 | T4.2 17.45,10.8 18.9,10.8 19.7,11.6 19.7,15.21 v19.29,15.62
  Bottom 1: U_DEBUG.3 CON1.29
  Bottom 1.016: 6.6,12.63 v6.6,7.01 | COMPOSITE_VIDEO.GND3 8.25,34.92 | v19.29,24 v19.29,15.62
  Bottom 1.27: CON1.2 3.81,2.16 1.02,4.95 v1.02,12.57 1.02,29.84 | 1.02,29.84 COMPOSITE_VIDEO.GND2 2.54,29.84 | CON2.2 3.81,41.15 1.02,38.35 1.02,34.84 | USB_HOST.4 6.6,12.63 7.68,12.63 9.27,14.22 9.27,18.41 | 9.27,18.41 C48.- | COMPOSITE_VIDEO.GND1 9.27,23.82 9.27,18.41 | CON2.4 8.89,35.56 8.25,34.92 | 1.02,34.84 COMPOSITE_VIDEO.GND3 | 1.02,29.84 1.02,34.84
  pour Top (isolate 0.4, rank 2): -1,44 -1,-1 77.5,-1 77.5,44
  pour Bottom (isolate 0.4, rank 3): -2,-2 78.5,-2 78.5,45 -2,45
HP_VGND  (via drill 0.4)
  Top 0.2: v30.1,21.3 30.4,21.6 U1.111
  Bottom 0.2: v30.1,21.3 30.1,22 29.7,22.4 29.4,22.4 28.9,22.9 28.9,23.5 27.2,25.2 27.2,30.4 31,34.2 31,38 31.5,38.5 33.8,38.5 35,39.7 42.24,39.7 42.74,40.2
  Bottom 1: 42.74,40.2 CON2.18
HPL  (via drill 0.4)
  Top 0.2: v30,19.9 30.4,19.9 31.3,20.8 U1.113
  Bottom 0.2: v30,19.9 28,21.9 27.2,21.9 26,23.1 26,31.7 30.2,35.9 30.2,38.4 31.1,39.3 33.4,39.3 34.6,40.5 37.96,40.5 38.46,41
  Bottom 1: 38.46,41 CON2.16
HPR  (via drill 0.4)
  Top 0.2: v27.6,22.57 29.15,22.57 29.32,22.4 U1.109
  Bottom 0.2: v27.6,22.57 26.4,23.77 26.4,31.5 30.6,35.7 30.6,38.2 31.3,38.9 33.6,38.9 34.8,40.1 40.1,40.1 40.6,40.6
  Bottom 1: 40.6,40.6 CON2.17
I2C_SCL
  Top 0.2: 17.3,41.4 18,40.7 26.62,40.7 27.02,40.3 36.9,40.3 37.4,39.8 60.4,39.8 63.9,36.3 63.9,20.4 62.2,18.7 62.2,14.9 61.9,14.6 SCL_HW/SCL_SW.2
  Top 1: 17.3,41.4 16.79,41.91 CON2.7 14.8,40.2 13.4,40.2 R11.1
I2C_SDA  (via drill 0.4)
  Top 0.2: R12.1 16.31,40.2 v17.3,40.2 17.4,40.3 26.4,40.3 26.8,39.9 36.7,39.9 37.2,39.4 58.8,39.4 63.1,35.1 63.1,20.7 60.9,18.5 v60.9,17.3 | v60.1,14.6 SDA_HW/SDA_SW.2
  Bottom 0.2: v60.9,17.3 60.9,15.4 v60.1,14.6
  Bottom 1: CON2.8 17.34,40.2 v17.3,40.2
LED1  (via drill 0.4, 0.6)
  Top 0.2: U1.88 37.4,27.6 37.3,27.5 36.5,27.5 35.4,26.4 35.4,24.7 35.7,24.4 35.7,16.3 33.6,14.2 31.8,14.2 31.4,13.8 27.1,13.8 25.9,12.6 25.9,11.7 23.3,9.1 22.45,9.1 20.73,10.82 v20.62,10.82
  Top 0.254: LED1.A 3.43,6.99 5.21,6.99 6.22,8 v11.4,8
  Bottom 0.25: v11.4,8 19.4,8 20.8,9.4 20.8,10.65 v20.62,10.82
LIN1_INL  (via drill 0.4)
  Top 0.2: U1.115 31.48,20 v31.38,19.9
  Bottom 0.2: v31.38,19.9 31.38,22.32 29.6,24.1 28.9,24.1 27.6,25.4 27.6,30.2 31.4,34 31.4,37.8 31.7,38.1 34,38.1 35.2,39.3 44.38,39.3 44.98,39.9
  Bottom 1: 44.98,39.9 CON2.19
LIN1_INR  (via drill 0.4)
  Top 0.2: U1.114 v33.9,20.4
  Bottom 0.2: v33.9,20.4 29.8,24.5 29.1,24.5 28,25.6 28,30 35.7,37.7 45.32,37.7 47.62,40
  Bottom 1: 47.62,40 CON2.20
N$1  (via drill 0.4)
  Top 0.2: 42.91,5.7 POWER.P$1 43.65,6.44 v43.65,10.15
  Bottom 0.2: v43.65,10.15 42.25,10.15 39.8,12.6 R6.1
N$2  (via drill 0.4)
  Top 0.2: 73.65,2.55 73.65,5.47
  Top 0.5: 74.05,2.15 73.65,2.55 | 73.65,5.47 73.65,12.25 66.5,19.4 v66.5,21 | v61.6,21 3.3V_E.1
  Top 1: CON1.30 74.05,2.15
  Bottom 0.5: v66.5,21 v61.6,21
N$3  (via drill 0.4, 0.6)
  Top 1: v45.8,3.1 46.7,3.1 46.9,2.9 64.3,2.9 65.7,4.3 65.7,7.1 63.8,9 63.8,13.77 USB_DEV.1
  Top 1.016: v21.3,8.1 21.3,8.95 20.95,9.3 v19.46,9.3 5V_E.1
  Bottom 0.4: FET1.2 15.9,20.15 15.9,16.35 T3.2 15.2,15.35 15.2,11.1 15.8,10.5 16.3,10.5 17.5,9.3 v19.46,9.3
  Bottom 0.8: 25,3.3 45.6,3.3 v45.8,3.1
  Bottom 1.016: 25,3.3 22.6,3.3 21,4.9 21,7.8 v21.3,8.1
N$4
  Top 0.5: 11.3,30.8 D2.3
  Top 1.016: 10.03,29.84 11.3,29.84 | 11.3,29.84 R26.2 | 11.3,29.84 11.3,30.8 C49.1
  Top 1.27: COMPOSITE_VIDEO.IO 10.03,29.84
N$5
  Top 0.5: U3.1 12.7,7.5
  Top 1: 12.7,7.5 12.7,9.2 L2.2
N$6
  Top 0.508: R3.2 10.54,5.25 U3.3
N$7
  Bottom 0.2: U2.49 39.75,28.55 41.75,30.55 41.75,32.59
  Bottom 0.5: C39.2 41.75,32.59 R19.2 R18.1 C38.2
N$8
  pour Bottom (isolate 0.406): 57.6,18.9 57.6,25.4 54.1,28.9 50.5,28.9 50.5,27.1 51.9,27.1 53,26 53,16.8 55.5,16.8
N$9
  Top 0.5: R5.1 61.7,7.47 RECOVERY.P$1
N$12
  Bottom 0.4: T3.3 17.7,19.1 17.7,20.05 FET1.1 18.2,20.55 R25.2
N$14
  Bottom 0.5: T4.3 17.7,14.9 17.7,15.95 T3.1
N$18
  Top 0.2: 31.7,27.4 31.9,27.2 U1.97
  Top 0.4: L1.2 25.62,34.22 23.6,32.2 23.6,29.7 24.8,28.5 26.41,28.5 C46.2 27.51,27.4 31.7,27.4
N$19
  Top 0.2: 31.7,26.4 U1.99
  Top 0.203: 31.4,26.7 31.7,26.4
  Top 0.4: 31.4,26.7 26.5,26.7 25.4,27.8 24.4,27.8 22.7,29.5 22.7,31.7 21.6,32.8 20.7,32.8 19.78,33.72 19.78,34.29 L1.1
  Top 0.5: C45.2 19.78,34.29
N$25
  Top 0.2: C26.2 28.89,19.2 U1.117
N$38
  Top 0.4: R8.1 C4.1
N$42
  Top 1.016: LED1.C 2.54,4.19 R2.2
N$43
  Top 1: T2.1 15.47,16.43 R10.1
  Top 1.016: R10.1 R9.1
N$101
  Bottom 0.3: RM3.4.1 31.79,7.8 D03_H.1
N$103
  Bottom 0.3: RM3.3.1 32.84,8.72 D02_H.1
N$104
  Bottom 0.3: RM3.2.1 32.4,9.48 D01_H.1
N$105
  Bottom 0.3: RM3.1.1 31.99,10.6 32.32,10.6 D00_H.1
N$266
  Top 1.27: USB_HOST.P$1 8.57,10.06 L3.2
  Bottom 1.27: 3.81,10.03 USB_HOST.P$1 USB_HOST.P$2
PIN1/LCD_D00  (via drill 0.4)
  Top 0.2: U1.2 34.6,12.38 31.93,9.7 29.57,9.7 v29.12,10.15 28.57,10.15 25.93,7.5 21.87,7.5 20.8,6.43 20.8,5.56 20.75,5.51
  Top 0.3: 7.7,2.62 7.92,2.62 8.9,3.6 13.68,3.6 14.65,4.57 16.34,4.57 16.84,5.08 20.32,5.08 20.75,5.51
  Top 1: CON1.3 7.7,2.62
  Bottom 0.2: RM3.1.2 30.02,10.15 v29.12,10.15 28.65,10.15 28.43,10.37 RM2.1.1
PIN2/LCD_D01  (via drill 0.4)
  Top 0.2: 21.24,5.23 21.24,6.3 22.04,7.1 26.1,7.1 28.27,9.28 v28.75,9.28 32.13,9.28 35,12.14 U1.3
  Top 0.3: 10.28,2.66 10.68,3.06 13.96,3.06 14.96,4.06 16.59,4.06 17.1,4.57 20.57,4.57 21.24,5.23
  Top 1: CON1.4 10.28,2.66
  Bottom 0.2: RM2.2.1 28.54,9.48 v28.75,9.28 29.35,9.28 29.56,9.48 RM3.2.2
PIN3/LCD_D02  (via drill 0.4)
  Top 0.2: U1.4 35.4,11.9 32.4,8.9 30.4,8.9 30.02,8.53 v29.27,8.53 28.12,8.53 26.3,6.7 22.2,6.7 21.7,6.2 21.7,4.94 21.64,4.88
  Top 0.3: 21.64,4.88 20.83,4.06 17.35,4.06 16.84,3.56 15.26,3.56 14.25,2.55 12.71,2.55 12.22,2.06
  Top 1: CON1.5 12.22,2.06
  Bottom 0.2: RM3.3.2 29.47,8.72 v29.27,8.53 28.57,8.53 28.38,8.72 RM2.3.1
PIN4/LCD_D03  (via drill 0.4)
  Top 0.2: 35.8,11.67 U1.5 | 26.39,6.2 27.99,7.8 v28.73,7.8 29.9,7.8 30.6,8.5 32.63,8.5 35.66,11.53
  Top 0.203: 35.66,11.53 35.8,11.67
  Top 0.3: 15.62,2.65 16.02,3.05 17.1,3.05 17.61,3.56 21.08,3.56 22.23,4.7 24.89,4.7 26.39,6.2
  Top 1: CON1.6 14.24,1.27 15.62,2.65
  Bottom 0.2: RM2.4.1 27.79,7.8 v28.73,7.8 30.21,7.8 RM3.4.2
PIN5/LCD_D04
  Top 0.2: 26.65,5.69 26.75,5.8 28.5,5.8 30.8,8.1 32.87,8.1 36.2,11.44 U1.6
  Top 0.3: 17.79,2.55 18.29,3.05 21.34,3.05 22.48,4.19 25.15,4.19 26.65,5.69
  Top 1: CON1.7 17.79,2.55
PIN6/LCD_D05  (via drill 0.4)
  Top 0.2: 27,5.29 27.12,5.4 28.7,5.4 31,7.7 33.1,7.7 36.6,11.2 U1.7
  Top 0.3: 19.92,2.14 20.33,2.55 21.6,2.55 22.73,3.68 25.4,3.68 27,5.29
  Top 1: CON1.8 19.92,2.14 | R14.2 6.77,3.9 v7.6,3.9
  Bottom 0.5: v7.6,3.9 8.1,3.4 16.92,3.4 17.03,3.29
  Bottom 1: 17.03,3.29 CON1.8
PIN7/LCD_D06
  Top 0.2: 27.26,4.68 27.28,4.7 33.1,4.7 33.8,5.4 33.8,7.8 37,11 U1.8
  Top 0.3: 23.09,2.77 23.5,3.17 25.75,3.17 27.26,4.68
  Top 1: CON1.9 23.09,2.77
PIN8/LCD_D07
  Top 0.2: U1.9 37.4,10.8 34.2,7.6 34.2,5.2 33.3,4.3 27.74,4.3 27.54,4.1
  Top 0.3: 25.13,2.27 25.36,2.5 25.94,2.5 27.54,4.1
  Top 1: CON1.10 25.13,2.27
PIN9/LCD_D08/SSP2_MISO  (via drill 0.4)
  Top 0.2: 34.1,3.9 34.5,3.9 34.7,3.7 35.1,3.7 | 35.1,3.7 37.98,3.7 42.2,7.92 42.2,10.9 42.6,11.3 U1.22 | 35.1,3.7 v35.1,5.35
  Top 0.3: 28.7,3.3 29.3,3.9 34.1,3.9
  Top 1: CON1.11 28.7,3.3
  Bottom 0.2: v35.1,5.35 34.75,5 25.8,5 24.1,6.7 24.1,14.1 23,15.2 23,38.9 21.59,40.31
  Bottom 1: 21.59,40.31 CON2.9
PIN10/LCD_D09
  Top 0.2: U1.23 43,11.1 42.6,10.7 42.6,7.78 38.12,3.3 34.4,3.3 34.3,3.4
  Top 0.3: 30.74,2.8 31.34,3.4 34.3,3.4
  Top 1: CON1.12 30.74,2.8
PIN11/LCD_D10
  Top 0.2: 34.5,2.8 34.6,2.9 38.27,2.9 43,7.62 43,10.5 43.4,10.9 U1.24
  Top 0.4: 32.98,2.5 33.28,2.8 34.5,2.8
  Top 1: CON1.13 32.98,2.5
PIN12/LCD_D11  (via drill 0.4)
  Top 0.2: U1.25 43.8,10.93 44.52,10.2 v44.52,9.85 44.52,5.42 43.1,4 40,4 38.5,2.5 35.52,2.5 35.42,2.4 | v57.1,16.7 CS_SW/CS_HW.3
  Top 0.4: 35.02,2 35.42,2.4
  Top 1: CON1.14 35.02,2
  Bottom 0.2: v44.52,9.85 44.77,9.6 55,9.6 55.3,9.9 55.3,10.8 54.5,11.6 54.5,13.5 57.1,16.1 v57.1,16.7
PIN13/LCD_D12  (via drill 0.4)
  Top 0.2: v40.6,2.2 41.6,3.2 43.5,3.2 45.7,5.4 45.7,10.2 44.6,11.3 U1.27
  Bottom 0.2: 37.76,2.2 38.06,2.5 40.3,2.5 v40.6,2.2
  Bottom 1: CON1.15 37.76,2.2
PIN14/LCD_D13
  Top 0.2: 39.37,2.07 40.9,3.6 43.3,3.6 45.3,5.6 45.3,10 44.2,11.1 U1.26
  Top 1: CON1.16 39.37,2.07
PIN15/LCD_D14  (via drill 0.4)
  Top 0.2: U1.29 45.4,11.7 46.5,10.6 46.5,5 45,3.5 45,2.7 v45.7,2
  Bottom 0.2: v45.7,2 45.2,2.5 43.14,2.5 42.74,2.1
  Bottom 1: CON1.17 42.74,2.1
PIN16/LCD_D15
  Top 0.2: U1.28 45,11.5 46.1,10.4 46.1,5.2 43.9,3 43.9,2.4
  Top 1: CON1.18 43.9,1.82 43.9,2.4
PIN17/LCD_D16/USB_FLAG  (via drill 0.4)
  Top 0.2: U1.19 41.4,11.9 41,11.5 41,8.3 38.4,5.7 37.6,5.7 37,5.1 v37,4.75
  Bottom 0.2: 46.45,3.75 46.2,4 37.75,4 v37,4.75
  Bottom 0.3: 46.45,3.75 46.99,3.21 46.99,2.61
  Bottom 1: 46.99,2.61 CON1.19
PIN18/LCD_D17/USB_EN  (via drill 0.4)
  Top 0.2: U1.20 41.8,11.7 41.4,11.3 41.4,8.18 38.27,5.05 v37.88,5.05
  Top 0.4: U3.4 14.35,5.25 13.5,4.4 v13.2,4.4 13,4.2 9.21,4.2 R4.2
  Bottom 0.2: 49.53,2.87 48,4.4 38.52,4.4 v37.88,5.05 37.52,5.4 36.7,5.4 35.5,4.2 23,4.2 21.82,5.38 21.82,6.72 22.2,7.1 22.2,8.4 21.6,9 21,9 16.4,4.4 v13.2,4.4
  Bottom 1: 49.53,2.87 CON1.20
PIN19/LCD_DOTCLK  (via drill 0.4)
  Top 0.2: v36.9,6.05 37.35,6.05 37.4,6.1 38.25,6.1 40.6,8.45 U1.17
  Bottom 0.2: 52.07,2.73 50,4.8 40.2,4.8 38.95,6.05 v36.9,6.05
  Bottom 1: 52.07,2.73 CON1.21
PIN20/LCD_VSYNC  (via drill 0.4)
  Top 0.2: v36.88,7 37.38,6.5 38.05,6.5 40.2,8.65 U1.16
  Bottom 0.2: 54.61,2.49 51.9,5.2 40.4,5.2 39.1,6.5 37.38,6.5 v36.88,7
  Bottom 1: 54.61,2.49 CON1.22
PIN21/LCD_HSYNC/I2C_SDA  (via drill 0.4)
  Top 0.2: v37.77,7.15 38.15,7.15 39.8,8.8 U1.15 | v52.8,5.3 52.8,6.2 53.2,6.6 53.2,10.5 54.5,11.8 57.9,11.8 58.8,12.7 58.8,13.06 SDA_HW/SDA_SW.1
  Bottom 0.2: 57.15,3.95 56.4,4.7 53.4,4.7 v52.8,5.3 52.5,5.6 40.55,5.6 39,7.15 v37.77,7.15
  Bottom 1: 57.15,3.95 CON1.23
PIN22/LCD_EN/I2C_SCL  (via drill 0.4)
  Top 0.2: U1.11 38.2,10.4 36.8,9 36.8,7.95 v36.85,7.9 | v53.7,5.7 53.6,5.8 53.6,10.3 54.7,11.4 58.3,11.4 59.5,12.6 60.44,12.6 SCL_HW/SCL_SW.1
  Bottom 0.2: v36.85,7.9 36.95,7.8 38.92,7.8 40.73,6 53.4,6 v53.7,5.7 54.3,5.1 57.3,5.1 59.69,2.71
  Bottom 1: 59.69,2.71 CON1.24
PIN23/LCD_DISP  (via drill 0.4)
  Top 0.2: U1.12 38.6,10.2 37.45,9.05 v37.45,8.62
  Bottom 0.2: v37.45,8.62 37.88,8.2 39.08,8.2 40.88,6.4 54.2,6.4 55.1,5.5 57.5,5.5 59.5,3.5 60.4,3.5 61.23,2.67
  Bottom 1: 61.23,2.67 62.23,1.67 CON1.25
PIN24/LCD_WR  (via drill 0.4)
  Top 0.2: U1.13 39,10.03 38.3,9.32 v38.3,8.95
  Bottom 0.2: v38.3,8.95 38.65,8.6 39.25,8.6 41.05,6.8 54.4,6.8 55.3,5.9 57.7,5.9 59.7,3.9 62.5,3.9 63.9,2.5
  Bottom 1: 63.9,2.5 64.77,1.63 CON1.26
PIN25/LCD_RS  (via drill 0.4)
  Top 0.2: v39.15,9.25 39.15,9.55 39.4,9.8 U1.14
  Top 0.4: v16.1,35.2 R15.2
  Bottom 0.2: 65,3.3 64,4.3 59.9,4.3 57.9,6.3 55.5,6.3 54.6,7.2 41.2,7.2 v39.15,9.25 38.8,9.6 37.4,9.6 36.2,8.4 36.2,5.5 35.3,4.6 25.6,4.6 23.7,6.5 23.7,13.9 22.6,15 22.6,29.1 16.5,35.2 v16.1,35.2
  Bottom 1: 65,3.3 67.03,1.27 CON1.27
PIN26/LCD_CS  (via drill 0.4)
  Top 0.2: U1.10 37.8,10.6 35.55,8.35 v35.55,8.03
  Bottom 0.2: v35.55,8.03 35.55,8.35 37.2,10 39.4,10 41.8,7.6 54.8,7.6 55.7,6.7 58.1,6.7 60.1,4.7 64.7,4.7 66.9,2.5 68.62,2.5
  Bottom 1: 68.62,2.5 CON1.28
PIN27/PWM2  (via drill 0.4)
  Top 0.2: U1.91 36.2,31 39.7,34.5 43.8,34.5 45.9,36.6 49.6,36.6 v49.75,36.75
  Bottom 0.2: 68.54,40.6 66.3,40.6 62.4,36.7 57.2,36.7 55.7,38.2 50.7,38.2 49.75,37.25 v49.75,36.75
  Bottom 1: 68.54,40.6 CON2.28
PIN28/SOFT_SDA  (via drill 0.4)
  Top 0.2: 68.62,40.6 70.6,40.6 71.1,40.1 71.1,38.4 69.6,36.9 66.8,36.9 65.3,35.4 v65.3,18.4 | U1.31 46.2,12.2 47.1,11.3 49.6,11.3 50,11.7 50,12.8 50.4,13.2 52,13.2 53,12.2 57.6,12.2 58.35,12.95 58.35,15.3 58.5,15.45 | SDA_HW/SDA_SW.3 v60.1,15.74
  Top 0.5: SDA_HW/SDA_SW.3 58.54,15.74 58.5,15.7 58.5,15.45
  Top 1: 68.62,40.6 CON2.27
  Bottom 0.2: v60.1,15.74 60.1,17.5 60.7,18.1 63.9,18.1 64.2,18.4 v65.3,18.4
PIN29/SOFT_SCL  (via drill 0.4)
  Top 0.2: v61.8,37.4 63.5,35.7 63.5,20.53 61.7,18.73 61.7,16.9 61.3,16.5 | 61.3,16.5 59.55,16.5 58.05,18 57.3,18 56.1,16.8 56.1,16.3 54.7,14.9 53.3,14.9 53,15.2 U1.34 | 61.3,16.5 SCL_HW/SCL_SW.3
  Bottom 0.2: v61.8,37.4 64.77,40.37
  Bottom 1: 64.77,40.37 CON2.26
PIN30  (via drill 0.4)
  Top 0.2: U1.81 40.2,29.7 40.4,29.9 46,29.9 47.1,31 50.15,31 50.85,30.3 51.2,30.3 v51.8,29.7
  Bottom 0.2: v51.8,29.7 51.7,29.8 51.7,31.3 51.2,31.8 51.2,33.3 49.1,35.4 49.1,37.2 50.5,38.6 58.92,38.6
  Bottom 1: 58.92,38.6 CON2.25
PIN31  (via drill 0.4)
  Top 0.2: U1.82 39.8,29.9 40.2,30.3 45.8,30.3 46.9,31.4 50.67,31.4 v51.05,31.02
  Bottom 0.2: v51.05,31.02 50.8,31.27 50.8,33.12 48.7,35.23 48.7,37.4 50.3,39 56.78,39 57.38,39.6
  Bottom 1: 57.38,39.6 CON2.24
PIN32/LRADC1  (via drill 0.4)
  Top 0.2: U1.107 33.83,23.2 34.35,22.68 v34.35,22.62
  Bottom 0.2: v34.35,22.62 33.67,23.3 32.8,23.3 30.4,25.7 29.7,25.7 29.2,26.2 29.2,29.4 36.3,36.5 47.1,36.5 50,39.4 54.64,39.4 55.14,39.9
  Bottom 1: 55.14,39.9 CON2.23
PIN33/LRADC0  (via drill 0.4)
  Top 0.2: U1.108 33.6,22.8 33.7,22.7 33.7,22.15 v34.1,21.75
  Bottom 0.2: v34.1,21.75 33.75,21.75 30.2,25.3 29.5,25.3 28.8,26 28.8,29.6 36.1,36.9 46.9,36.9 49.8,39.8 52.5,39.8 53,40.3
  Bottom 1: 53,40.3 CON2.22
PIN34/MIC  (via drill 0.4)
  Top 0.2: U1.116 34.1,19.6 34.95,20.45 v34.95,21.3
  Bottom 0.2: v34.95,21.3 34.7,21.05 33.85,21.05 30,24.9 29.3,24.9 28.4,25.8 28.4,29.8 35.9,37.3 46.66,37.3 49.56,40.2 50.36,40.2 50.96,40.8
  Bottom 1: 50.96,40.8 CON2.21
PSWITCH  (via drill 0.4)
  Top 0.2: v28.3,18.05 28.65,18.4 U1.119 | v54.6,10.3 56.51,10.3 R7.1
  Bottom 0.2: v28.3,18.05 28.9,17.45 28.9,13.8 29.2,13.5 39.5,13.5 42.1,10.9 44.5,10.9 45.2,10.2 54.5,10.2 v54.6,10.3
PWM0/DUART_RXD  (via drill 0.4)
  Top 0.2: U1.125 31.1,16 30.5,15.4 25.6,15.4 25.3,15.1 v25.3,14.15
  Bottom 0.2: 73.64,5.1 60.3,5.1 58.3,7.1 55.9,7.1 55,8 42.1,8 39.7,10.4 36.8,10.4 34.9,8.5 34.9,6.7 34,5.8 26.2,5.8 24.9,7.1 24.9,13.5 25.3,13.9 v25.3,14.15 23.8,15.65 23.8,33.31 R22.2 24.89,34.4 25.3,34.4 27.3,36.4 27.3,36.8 30.5,40 30.5,40.66 30.8,40.96
  Bottom 1: 73.64,5.1 U_DEBUG.1 | 30.8,40.96 CON2.13
PWM1/DUART_TXD  (via drill 0.4)
  Top 0.2: U1.126 31.3,15.6 30.7,15 26.23,15 v25.98,14.75
  Top 1: v72.39,6 U_DEBUG.2
  Bottom 0.2: v72.39,6 71.8,6 71.3,5.5 60.5,5.5 58.5,7.5 56.1,7.5 55.2,8.4 42.3,8.4 39.9,10.8 36.6,10.8 34.5,8.7 34.5,6.9 33.8,6.2 26.4,6.2 25.3,7.3 25.3,13.2 25.98,13.88 v25.98,14.75 25.98,15.12 24.2,16.9 24.2,32.25 27.7,35.75 27.7,36.6 30.8,39.7 31.8,39.7 33,40.9
  Bottom 1: 33,40.9 34.01,41.91 CON2.14
RASN  (via drill 0.4)
  Top 0.2: U1.62 49.23,26.4 49.42,26.6 51,26.6 51.4,26.2 v52.2,26.2
  Bottom 0.2: U2.23 36.5,16 39.6,19.1 42.2,19.1 44,20.9 49.6,20.9 51.9,23.2 51.9,25.9 v52.2,26.2
RESET  (via drill 0.6)
  Top 0.5: 18.7,13.18 v18.7,13.5
  Top 1: v20.72,13.18 18.7,13.18 R9.2
  Top 1.016: RESET.P$1 23.86,5.7 v22.62,5.7
  Bottom 0.5: T4.1 18.7,12.75 v18.7,13.5
  Bottom 0.508: v22.62,5.7 22.8,5.88 22.8,8.7 21.5,10 21.5,12.4 v20.72,13.18
SD_VCC  (via drill 0.4)
  Top 0.2: 59.1,37.5 59.4,37.5 62,34.9 v62,30.6
  Top 0.4: JTAG.5 73.86,30.86 71.75,28.75 SD.4
  Top 0.5: 59.1,37.5 58.12,37.5 L4.2 55.98,37.82 C44.2 C29.2
  Bottom 0.2: v62,30.6 71.64,30.6 71.91,30.86
  Bottom 1: 71.91,30.86 JTAG.5
SJTAG_PSW  (via drill 0.4)
  Top 0.2: 38,41 38.4,40.6 61,40.6 63.9,37.7 65.1,37.7
  Top 0.4: R8.2 R7.2 55.33,7.34 RECOVERY.P$2
  Top 0.5: v58.9,34.66 58.9,34.4 58.46,33.96 RM1.1.2 | 65.1,37.7 65.1,36.3 64.8,36 64.8,19.1 62.8,17.1 62.8,8.5 64.7,6.6 64.7,4.8 64.2,4.3 56.7,4.3 56.1,4.9 55.33,4.9 | 55.33,4.9 RECOVERY.P$2 | POWER.P$2 52.37,4.4 54.2,4.4 54.7,4.9 55.33,4.9
  Top 1: 38,41 37.09,41.91 CON2.15 | SJTAG.3 69.85,38.85 68.7,37.7 65.1,37.7
  Bottom 0.5: 69.85,36.45 69.85,36.15 68.36,34.66 v58.9,34.66
  Bottom 1: SJTAG.3 69.85,36.45
SSP1_CMD  (via drill 0.4)
  Top 0.2: U1.83 39.4,30.1 40,30.7 45.6,30.7 46.7,31.8 51.2,31.8 52,31 55.3,31 55.6,30.7 56.1,30.7 v56.4,30.4 56.4,29.09 R21.1
  Top 0.4: JTAG.6 73.81,32.12 71.55,29.85 SD.3
  Bottom 0.2: 71.92,32.12 71.3,31.5 57.5,31.5 v56.4,30.4
  Bottom 1: 71.92,32.12 JTAG.6
SSP1_DATA0  (via drill 0.4)
  Top 0.2: U1.84 39,30.35 40.75,32.1 45,32.1 46.1,33.2 51,33.2 51.1,33.1 52,33.1 53,32.1 v53.7,32.1 54.1,31.7 55.92,31.7 RM1.4.1
  Top 0.4: SD.7 71.95,25.45 73.61,27.11 JTAG.2
  Bottom 0.2: v53.7,32.1 53.9,31.9 53.9,29.9 54.6,29.2 69.5,29.2 71.58,27.11
  Bottom 1: 71.58,27.11 JTAG.2
SSP1_DATA1  (via drill 0.4)
  Top 0.2: U1.85 38.6,30.52 40.58,32.5 44.8,32.5 45.9,33.6 51.2,33.6 51.3,33.5 52.55,33.5 v53.2,32.85 54.47,32.85 55.01,32.31 RM1.3.1
  Top 0.4: SD.8 72.15,24.35 73.67,25.86 JTAG.1
  Bottom 0.2: v53.2,32.85 53,32.65 53,31.85 53.5,31.35 53.5,29.7 54.4,28.8 68.7,28.8 71.64,25.86
  Bottom 1: 71.64,25.86 JTAG.1
SSP1_DATA2  (via drill 0.4)
  Top 0.2: U1.86 38.2,30.65 40.45,32.9 44.6,32.9 45.7,34 51.3,34 51.4,33.9 53.2,33.9 53.7,33.4 v55.1,33.4 55.43,33.07 RM1.2.1
  Top 0.4: SD.1 71.25,32.05 73.81,34.62 JTAG.8
  Bottom 0.2: v55.1,33.4 56.1,32.4 69.5,32.4 69.8,32.7
  Bottom 0.5: 69.8,32.7 71.72,34.62
  Bottom 1: 71.72,34.62 JTAG.8
SSP1_DATA3  (via drill 0.4)
  Top 0.2: v55.05,30.29 55.05,27.95 56.7,26.3 R20.1 | U1.87 37.8,30.8 40.3,33.3 44.4,33.3 45.5,34.4 51.5,34.4 51.6,34.3 54.1,34.3 v54.3,34.1
  Top 0.4: SD.2 71.55,30.95 73.97,33.37 JTAG.7
  Bottom 0.2: v54.3,34.1 54.3,33.25 55.05,32.5 55.05,31.9 | 55.05,31.9 v55.05,30.29 | 55.05,31.9 70.45,31.9 71.92,33.37
  Bottom 1: 71.92,33.37 JTAG.7
SSP1_SCK  (via drill 0.4)
  Top 0.2: U1.90 36.6,30.8 39.9,34.1 44,34.1 46.1,36.2 48.3,36.2 48.4,36.1 50.9,36.1 52.05,34.95 v53.2,34.95
  Top 0.4: JTAG.4 73.81,29.61 71.85,27.65 SD.5
  Bottom 0.2: v53.2,34.95 53.6,34.55 53.6,33.4 54.4,32.6 54.4,30 54.78,29.61 71.92,29.61
  Bottom 1: 71.92,29.61 JTAG.4
SSP2_MOSI  (via drill 0.4)
  Top 0.2: v35.4,6.25 35.9,5.75 35.9,4.6 36.4,4.1 37.85,4.1 41.8,8.05 41.8,11.1 42.2,11.5 U1.21
  Bottom 0.2: v35.4,6.25 35.05,6.25 34.2,5.4 26,5.4 24.5,6.9 24.5,14.3 23.4,15.4 23.4,37.3 24.13,38.03
  Bottom 1: 24.13,38.03 CON2.10
SSP2_SCK  (via drill 0.4)
  Top 0.2: 27.48,41.1 27.88,40.7 37.1,40.7 37.6,40.2 60.7,40.2 64.3,36.6 64.3,19.8 v63.3,18.8 | v56.02,14 53.6,14 52.8,14.8 U1.33
  Top 1: 27.48,41.1 CON2.11
  Bottom 0.2: v56.02,14 58.5,16.48 58.5,17.9 59.1,18.5 63,18.5 v63.3,18.8
USB_DM
  Top 0.2: U1.123 30.7,16.8 30.1,16.2 25.2,16.2 24.1,15.1
  Top 0.254: 24.1,15.1 24.1,12.46 23.3,11.66 21.73,11.66 21.1,12.29 14.71,12.29 13.86,13.15 13.86,14.42 12.3,15.98 10.94,15.98 9.78,17.14
  Top 1.016: USB_HOST.2 6.52,17.14 9.78,17.14
USB_DP
  Top 0.2: 24.6,15 25.4,15.8 30.3,15.8 30.9,16.4 U1.124
  Top 0.254: 24.6,15 24.6,12.2 23.55,11.15 21.48,11.15 20.84,11.78 14.46,11.78 13.35,12.89 13.35,14.01 12.24,15.11 9.78,15.11
  Top 1.016: USB_HOST.3 6.52,15.11 9.78,15.11
V+  (via drill 0.4)
  Top 0.2: C5.2 51.71,16.8 U1.38 | C6.2 U1.45 | U1.53 49.1,22.8 50.1,21.8 C7.2 | 32.7,23.6 U1.106 30.5,23.6 29.8,24.3 | v52.5,11.7 51.7,12.5 v50.7,12.5
  Top 0.3: v48.9,29.95 49.45,29.95 50.6,28.8 53,28.8 55.8,26 55.8,24.1 54.53,22.83 51.91,22.83
  Top 0.5: 51.91,18.5 51.91,17.1 C5.2 | 51.91,18.5 C6.2 C7.2 51.91,22.83 R16.2 | v52.4,18.5 51.91,18.5 | v29.68,23.1 29.57,23.2 29.09,23.2 C8.2 28.99,24.3 29.8,24.3
  Bottom 0.2: 47.55,27.55 47.4,27.7 47.4,28.5 48.1,29.2 48.1,30.51 C37.2 | U2.33 30,18.1 28.99,19.11 C32.2 | C32.2 26.9,19 27.2,18.7 28.6,18.7 29.3,18 29.3,14.2 29.6,13.9 39.75,13.9 | U2.1 50.8,16.4 51.6,17.2 51.6,20.8 52.41,21.61 C33.2 | U2.3 49.5,14.2 49.65,14.05 51.65,14.05 53.5,15.9 53.5,16.5 C30.2 | C31.2 55.8,15.38 54,13.57 54,12.2 52.4,10.6 45.4,10.6 44.7,11.3 42.3,11.3 39.75,13.85 39.75,13.9 | 39.75,13.9 U2.18 | 42.9,11.9 44.7,11.9 45.6,11 51.8,11 v52.5,11.7 | v29.68,23.1 30.9,21.88 30.9,20.6 30.7,20.4 30.7,19.5 30.4,19.2 29.7,19.2 29.3,19.6 27.39,19.6 C32.2 | v50.7,12.5 46.71,12.5 C34.2
  Bottom 0.203: U2.9 45.6,13.9 45.81,13.69 | U2.15 41.7,13.9 41.91,13.69
  Bottom 0.4: C34.2 45.81,13.69 | 41.91,13.69 C35.2 42.2,13.11 42.2,12.6 42.9,11.9 | 43.65,28.8 U2.55 | 47.55,27.55 U2.61 | R18.2 C38.1 C37.2 | 55.1,16.81 55.1,15.38 53.4,13.68 53.4,12.6 v52.5,11.7
  Bottom 0.5: R18.2 44.4,30.51 44.4,29.51 C36.2 43.65,28.8 | C31.2 55.1,16.81 C30.2 | 53.5,16.5 52.7,16.5 52.4,16.8 v52.4,18.5 52.4,19.8 53.5,20.9 C33.2 | C37.2 48.7,30.81 48.9,30.61 v48.9,29.95
VCC  (via drill 0.4)
  Top 0.2: U1.92 35.8,31.45 36,31.65 | 41.2,14.5 41,14.3 U1.18
  Top 0.5: 36,31.65 39.45,35.1 40.7,35.1 41.1,35.5 41.1,35.7 | RESET.P$2 32.55,6.26 v32.55,6.9 | 41.2,14.5 46.9,14.5 47.6,13.8 48.3,13.8 | 57.73,32.7 RM1.3.2 RM1.4.2 57.73,30.47 57.79,30.41 R21.2 57.79,23.81 59.32,22.28 3.3V_E.2 | 57.73,32.7 RM1.2.2 | L4.1 59.22,35.78 59.8,35.2 59.8,33.9 v59.1,33.2 58.6,32.7 57.73,32.7 | v55.3,13.3 53.4,13.3 52.5,14.2 49.7,14.2 49.3,13.8 48.3,13.8 | v33.45,31.62 33.38,31.7 28.9,31.7 27.6,33 v27.6,38.6 | 41.1,35.7 v42.9,35.7 44,35.7 45.95,37.65 50.55,37.65 v51.5,36.7 | 41.1,35.7 C40.2 | 48.3,13.8 C3.2 | v27.6,38.6 27.4,38.8 18,38.8 17.8,38.6 17.8,37.9 17.25,37.35 16.84,37.35 R13.2 R12.2 R11.2 13.01,36.72 R15.1 13.15,35.06 D2.2 | R1.1 29.16,38.6 v27.6,38.6
  Top 0.52: v61.7,11.9 R5.2 | v59.32,17.72 3.3V_E.2
  Bottom 0.5: 72.86,37.3 68.76,33.2 v59.1,33.2 58.4,33.2 54.8,36.8 51.6,36.8 v51.5,36.7 | v32.55,6.9 32.65,6.8 33.5,6.8 33.88,7.18 D03_H.2 D02_H.2 D01_H.2 D00_H.2 40.15,11.4 42.55,9 56.2,9 59.1,11.9 | v33.45,31.62 33.6,31.62 37.48,35.5 42.7,35.5 v42.9,35.7 | R22.1 24.71,36 25,36 v27.6,38.6
  Bottom 0.52: 59.1,13.1 55.5,13.1 v55.3,13.3 | v59.32,17.72 59.1,17.5 59.1,13.1 | 59.1,13.1 59.1,11.9 v61.7,11.9
  Bottom 1: 72.86,37.3 SJTAG.1
VDAC1
  Top 0.2: U1.104 31.7,24.4 30.7,25.4 25.9,25.4 24.8,26.5 12.81,26.5 R26.1
VDD4P2
  Top 0.2: U1.101 31.7,25.6 31.1,26.2 26.3,26.2 25.2,27.3 23.92,27.3 22,29.22 22,31.4 21.2,32.2 18.9,32.2 18.5,31.8 C9.2
  Top 0.5: C10.2 17.21,31 18.5,31 | 18.5,31 C9.2 | 18.5,31 D1.K
VDDXTAL  (via drill 0.4)
  Top 0.2: v27.1,17.65 27.35,17.4 29.15,17.4 29.75,18 U1.120 | C22.2 28.21,12.68 v29.05,12.68
  Bottom 0.2: v27.1,17.65 28.5,16.25 28.5,13.22 v29.05,12.68 31.77,12.68 32.1,13 35.01,13 R6.2
VPP
  Top 0.508: 8.9,39.75 VR1.5
  Top 0.762: 7.11,41.15 8.51,39.75 8.9,39.75 10.44,39.75 C43.1
  Top 1.27: CON2.3 7.11,41.15
WEN  (via drill 0.4)
  Top 0.2: U1.77 41.8,27 40.6,25.8 40.6,25.5 38.1,23 38.1,20.2 40.3,18 v40.7,18
  Bottom 0.2: U2.21 37.8,16.1 39.7,18 v40.7,18
XTALI
  Top 0.2: 22.48,16.6 29.6,16.6 30.2,17.2 U1.122
  Top 1.016: T2.3 16.36,18.41 C23.2 21.47,18.41 22.48,17.4 22.48,16.6 Q1.2
XTALO
  Top 0.2: U1.121 30,17.6 29.4,17 26.31,17 26.29,17.02
  Top 0.254: 22.48,20.83 26.29,17.02
  Top 1.016: T1.3 16.36,20.83 C24.2 22.48,20.83 Q1.1